# EAGLE design etcolor (EAGLE 6.1)
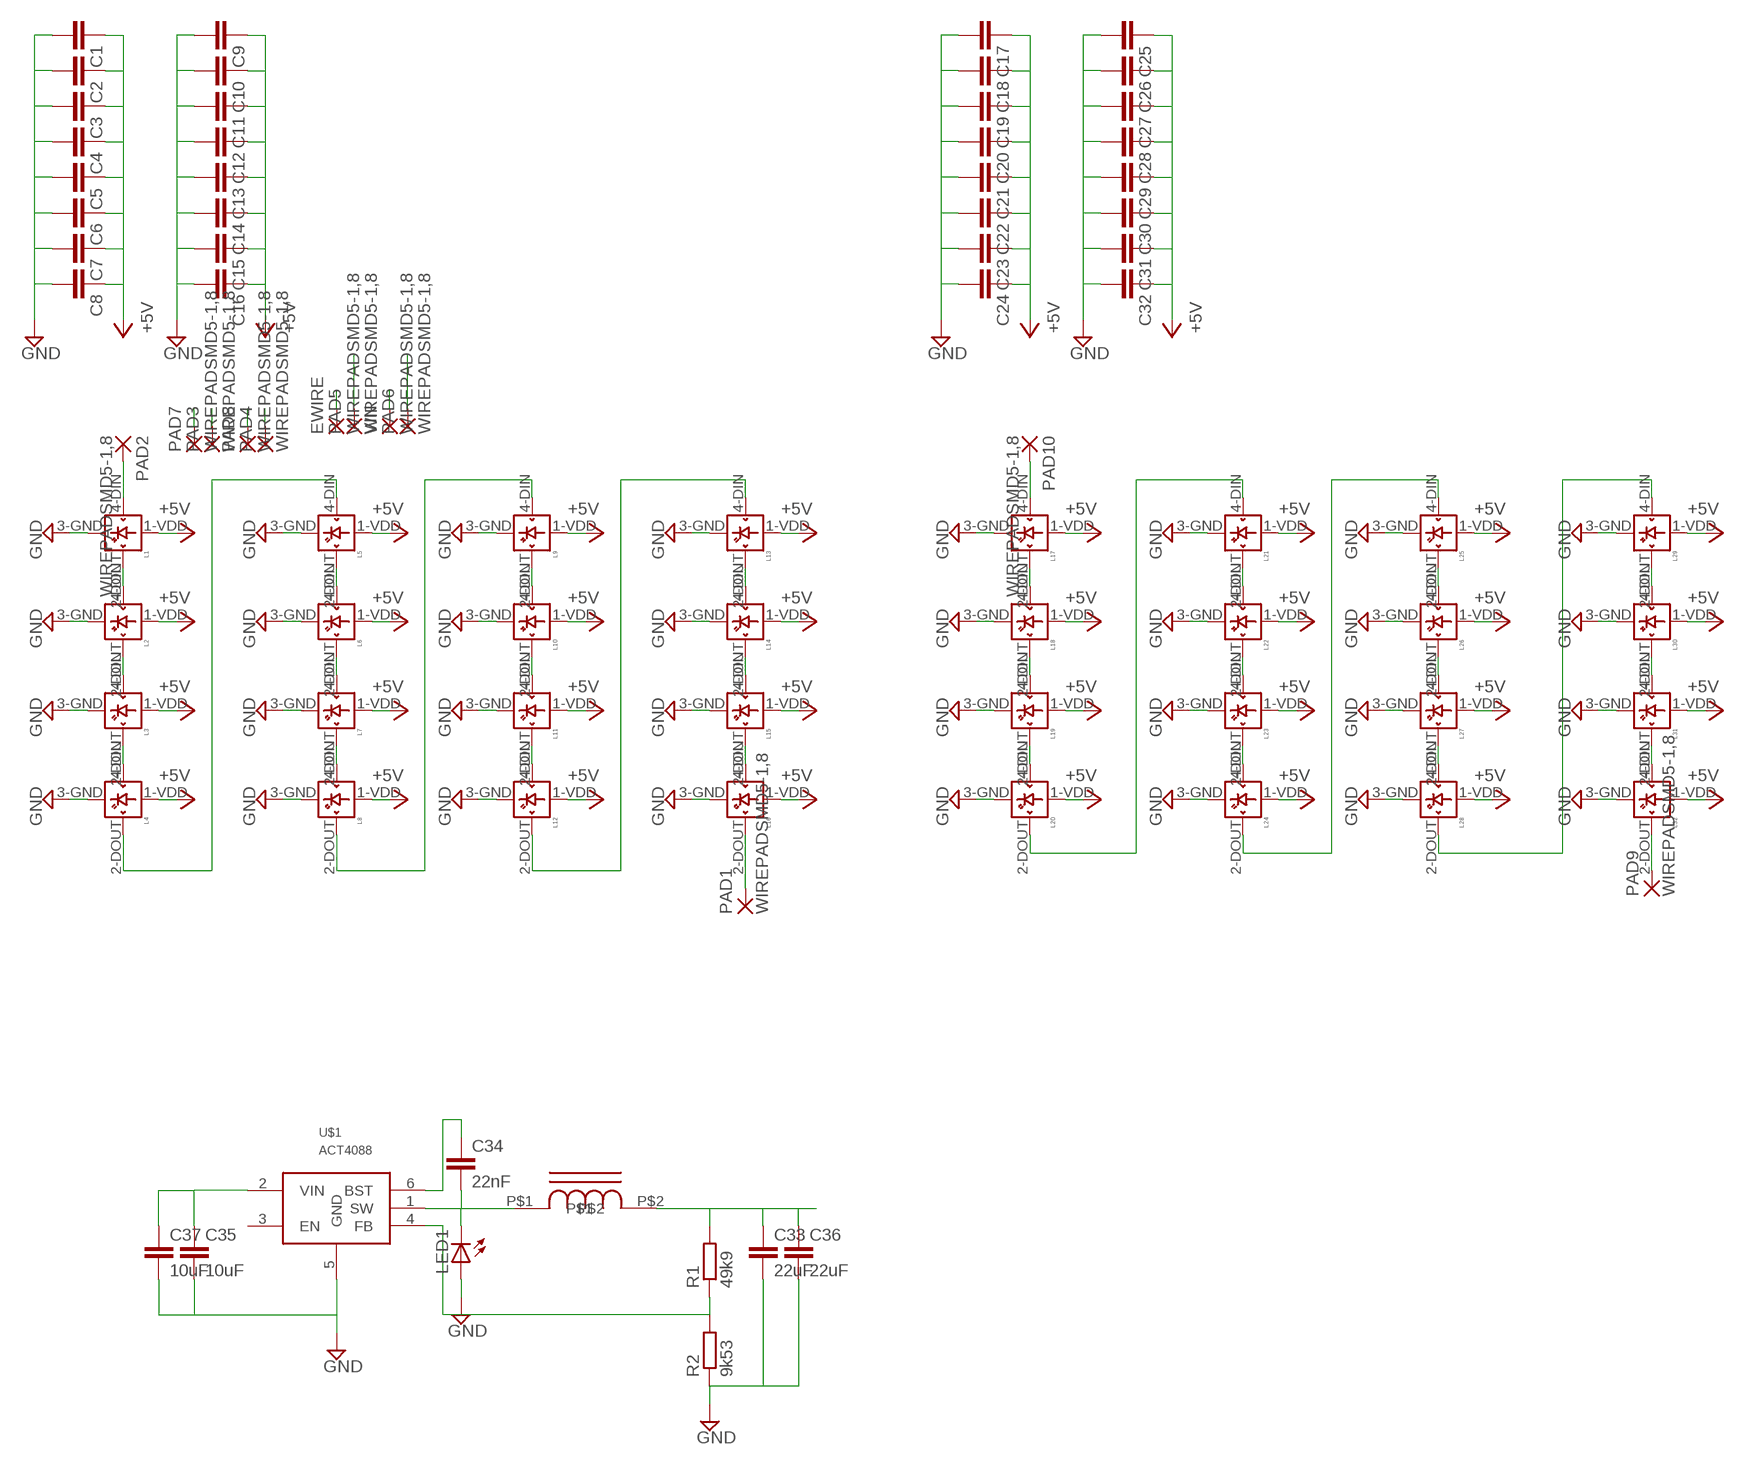
[diagram p0: schematic, sheet 1]

## Parts
C1  C-EUC0805K  [C0805K]
C2  C-EUC0805K  [C0805K]
C3  C-EUC0805K  [C0805K]
C4  C-EUC0805K  [C0805K]
C5  C-EUC0805K  [C0805K]
C6  C-EUC0805K  [C0805K]
C7  C-EUC0805K  [C0805K]
C8  C-EUC0805K  [C0805K]
C9  C-EUC0805K  [C0805K]
C10  C-EUC0805K  [C0805K]
C11  C-EUC0805K  [C0805K]
C12  C-EUC0805K  [C0805K]
C13  C-EUC0805K  [C0805K]
C14  C-EUC0805K  [C0805K]
C15  C-EUC0805K  [C0805K]
C16  C-EUC0805K  [C0805K]
C17  C-EUC0805K  [C0805K]
C18  C-EUC0805K  [C0805K]
C19  C-EUC0805K  [C0805K]
C20  C-EUC0805K  [C0805K]
C21  C-EUC0805K  [C0805K]
C22  C-EUC0805K  [C0805K]
C23  C-EUC0805K  [C0805K]
C24  C-EUC0805K  [C0805K]
C25  C-EUC0805K  [C0805K]
C26  C-EUC0805K  [C0805K]
C27  C-EUC0805K  [C0805K]
C28  C-EUC0805K  [C0805K]
C29  C-EUC0805K  [C0805K]
C30  C-EUC0805K  [C0805K]
C31  C-EUC0805K  [C0805K]
C32  C-EUC0805K  [C0805K]
C33  22uF  C-EUC1210  [C1210]
C34  22nF  C-EUC0805  [C0805]
C35  10uF  C-EUC1210  [C1210]
C36  22uF  C-EUC1210  [C1210]
C37  10uF  C-EUC1210  [C1210]
EWIRE  WIREPADSMD5-1,8  [5-1,8]
L1  WS2812B  [WS2812B]
L2  WS2812B  [WS2812B]
L3  WS2812B  [WS2812B]
L4  WS2812B  [WS2812B]
L5  WS2812B  [WS2812B]
L6  WS2812B  [WS2812B]
L7  WS2812B  [WS2812B]
L8  WS2812B  [WS2812B]
L9  WS2812B  [WS2812B]
L10  WS2812B  [WS2812B]
L11  WS2812B  [WS2812B]
L12  WS2812B  [WS2812B]
L13  WS2812B  [WS2812B]
L14  WS2812B  [WS2812B]
L15  WS2812B  [WS2812B]
L16  WS2812B  [WS2812B]
L17  WS2812B  [WS2812B]
L18  WS2812B  [WS2812B]
L19  WS2812B  [WS2812B]
L20  WS2812B  [WS2812B]
L21  WS2812B  [WS2812B]
L22  WS2812B  [WS2812B]
L23  WS2812B  [WS2812B]
L24  WS2812B  [WS2812B]
L25  WS2812B  [WS2812B]
L26  WS2812B  [WS2812B]
L27  WS2812B  [WS2812B]
L28  WS2812B  [WS2812B]
L29  WS2812B  [WS2812B]
L30  WS2812B  [WS2812B]
L31  WS2812B  [WS2812B]
L32  WS2812B  [WS2812B]
LED1  LED1206  [LED-1206]
PAD1  WIREPADSMD5-1,8  [5-1,8]
PAD2  WIREPADSMD5-1,8  [5-1,8]
PAD3  WIREPADSMD5-1,8  [5-1,8]
PAD4  WIREPADSMD5-1,8  [5-1,8]
PAD5  WIREPADSMD5-1,8  [5-1,8]
PAD6  WIREPADSMD5-1,8  [5-1,8]
PAD7  WIREPADSMD5-1,8  [5-1,8]
PAD8  WIREPADSMD5-1,8  [5-1,8]
PAD9  WIREPADSMD5-1,8  [5-1,8]
PAD10  WIREPADSMD5-1,8  [5-1,8]
R1  49k9  R-EU_M0805  [M0805]
R2  9k53  R-EU_M0805  [M0805]
U$1  ACT4088  [SOT23-6]
U$2  INDUCTOR  [6060]
VIN  WIREPADSMD5-1,8  [5-1,8]

## Nets
+5V: C1.1 C2.1 C3.1 C4.1 C5.1 C6.1 C7.1 C8.1 C9.1 C10.1 C11.1 C12.1 C13.1 C14.1 C15.1 C16.1 C17.1 C18.1 C19.1 C20.1 C21.1 C22.1 C23.1 C24.1 C25.1 C26.1 C27.1 C28.1 C29.1 C30.1 C31.1 C32.1 C33.1 C36.1 L1.1-VDD(VDD) L2.1-VDD(VDD) L3.1-VDD(VDD) L4.1-VDD(VDD) L5.1-VDD(VDD) L6.1-VDD(VDD) L7.1-VDD(VDD) L8.1-VDD(VDD) L9.1-VDD(VDD) L10.1-VDD(VDD) L11.1-VDD(VDD) L12.1-VDD(VDD) L13.1-VDD(VDD) L14.1-VDD(VDD) L15.1-VDD(VDD) L16.1-VDD(VDD) L17.1-VDD(VDD) L18.1-VDD(VDD) L19.1-VDD(VDD) L20.1-VDD(VDD) L21.1-VDD(VDD) L22.1-VDD(VDD) L23.1-VDD(VDD) L24.1-VDD(VDD) L25.1-VDD(VDD) L26.1-VDD(VDD) L27.1-VDD(VDD) L28.1-VDD(VDD) L29.1-VDD(VDD) L30.1-VDD(VDD) L31.1-VDD(VDD) L32.1-VDD(VDD) R1.2 U$2.P$2
BTS: C34.1 U$1.6(BST)
DATAIN1: L1.4-DIN(DIN) PAD2.1(P)
DATAIN2: L17.4-DIN(DIN) PAD10.1(P)
DATAOUT1: L16.2-DOUT(DOUT) PAD1.1(P)
DATAOUT2: L32.2-DOUT(DOUT) PAD9.1(P)
FB: R1.1 R2.2 U$1.4(FB)
GND: C1.2 C2.2 C3.2 C4.2 C5.2 C6.2 C7.2 C8.2 C9.2 C10.2 C11.2 C12.2 C13.2 C14.2 C15.2 C16.2 C17.2 C18.2 C19.2 C20.2 C21.2 C22.2 C23.2 C24.2 C25.2 C26.2 C27.2 C28.2 C29.2 C30.2 C31.2 C32.2 C33.2 C35.2 C36.2 C37.2 L1.3-GND(GND) L2.3-GND(GND) L3.3-GND(GND) L4.3-GND(GND) L5.3-GND(GND) L6.3-GND(GND) L7.3-GND(GND) L8.3-GND(GND) L9.3-GND(GND) L10.3-GND(GND) L11.3-GND(GND) L12.3-GND(GND) L13.3-GND(GND) L14.3-GND(GND) L15.3-GND(GND) L16.3-GND(GND) L17.3-GND(GND) L18.3-GND(GND) L19.3-GND(GND) L20.3-GND(GND) L21.3-GND(GND) L22.3-GND(GND) L23.3-GND(GND) L24.3-GND(GND) L25.3-GND(GND) L26.3-GND(GND) L27.3-GND(GND) L28.3-GND(GND) L29.3-GND(GND) L30.3-GND(GND) L31.3-GND(GND) L32.3-GND(GND) LED1.A PAD3.1(P) PAD4.1(P) PAD7.1(P) PAD8.1(P) R2.1 U$1.5(GND)
N$1: L1.2-DOUT(DOUT) L2.4-DIN(DIN)
N$2: L2.2-DOUT(DOUT) L3.4-DIN(DIN)
N$4: L3.2-DOUT(DOUT) L4.4-DIN(DIN)
N$5: L4.2-DOUT(DOUT) L5.4-DIN(DIN)
N$6: L5.2-DOUT(DOUT) L6.4-DIN(DIN)
N$7: L6.2-DOUT(DOUT) L7.4-DIN(DIN)
N$8: L7.2-DOUT(DOUT) L8.4-DIN(DIN)
N$9: L8.2-DOUT(DOUT) L9.4-DIN(DIN)
N$10: L9.2-DOUT(DOUT) L10.4-DIN(DIN)
N$11: L10.2-DOUT(DOUT) L11.4-DIN(DIN)
N$12: L11.2-DOUT(DOUT) L12.4-DIN(DIN)
N$13: L12.2-DOUT(DOUT) L13.4-DIN(DIN)
N$14: L13.2-DOUT(DOUT) L14.4-DIN(DIN)
N$15: L14.2-DOUT(DOUT) L15.4-DIN(DIN)
N$16: L15.2-DOUT(DOUT) L16.4-DIN(DIN)
N$18: L17.2-DOUT(DOUT) L18.4-DIN(DIN)
N$19: L18.2-DOUT(DOUT) L19.4-DIN(DIN)
N$20: L19.2-DOUT(DOUT) L20.4-DIN(DIN)
N$21: L20.2-DOUT(DOUT) L21.4-DIN(DIN)
N$22: L21.2-DOUT(DOUT) L22.4-DIN(DIN)
N$23: L22.2-DOUT(DOUT) L23.4-DIN(DIN)
N$24: L23.2-DOUT(DOUT) L24.4-DIN(DIN)
N$25: L24.2-DOUT(DOUT) L25.4-DIN(DIN)
N$26: L25.2-DOUT(DOUT) L26.4-DIN(DIN)
N$27: L26.2-DOUT(DOUT) L27.4-DIN(DIN)
N$28: L27.2-DOUT(DOUT) L28.4-DIN(DIN)
N$29: L28.2-DOUT(DOUT) L29.4-DIN(DIN)
N$30: L29.2-DOUT(DOUT) L30.4-DIN(DIN)
N$31: L30.2-DOUT(DOUT) L31.4-DIN(DIN)
N$32: L31.2-DOUT(DOUT) L32.4-DIN(DIN)
SW: C34.2 LED1.C U$1.1(SW) U$2.P$1
VIN: C35.1 C37.1 EWIRE.1(P) PAD5.1(P) PAD6.1(P) U$1.2(VIN) VIN.1(P)
Unconnected: U$1.3(EN)

## Library data of the parts
C1-C32 C34 = resistor:C-EU: CAPACITOR, European symbol
C33 C35-C37 = rcl:C-EU: CAPACITOR, European symbol
EWIRE PAD1-PAD10 VIN = wirepad:WIREPAD: Wire PAD connect wire on PCB
L1-L32 = adafruit:WS2812B
LED1 = LilyPad-Wearables:LED: LEDs Standard schematic elements and footprints for 5mm, 3mm, 1206, and 0603 sized LEDs. 5mm - Spark Fun Electronics SKU : Comp-SBL
R1 R2 = rcl:R-EU_: RESISTOR, European symbol
U$1 = wes:ACT4088
U$2 = wes:INDUCTOR

## Board
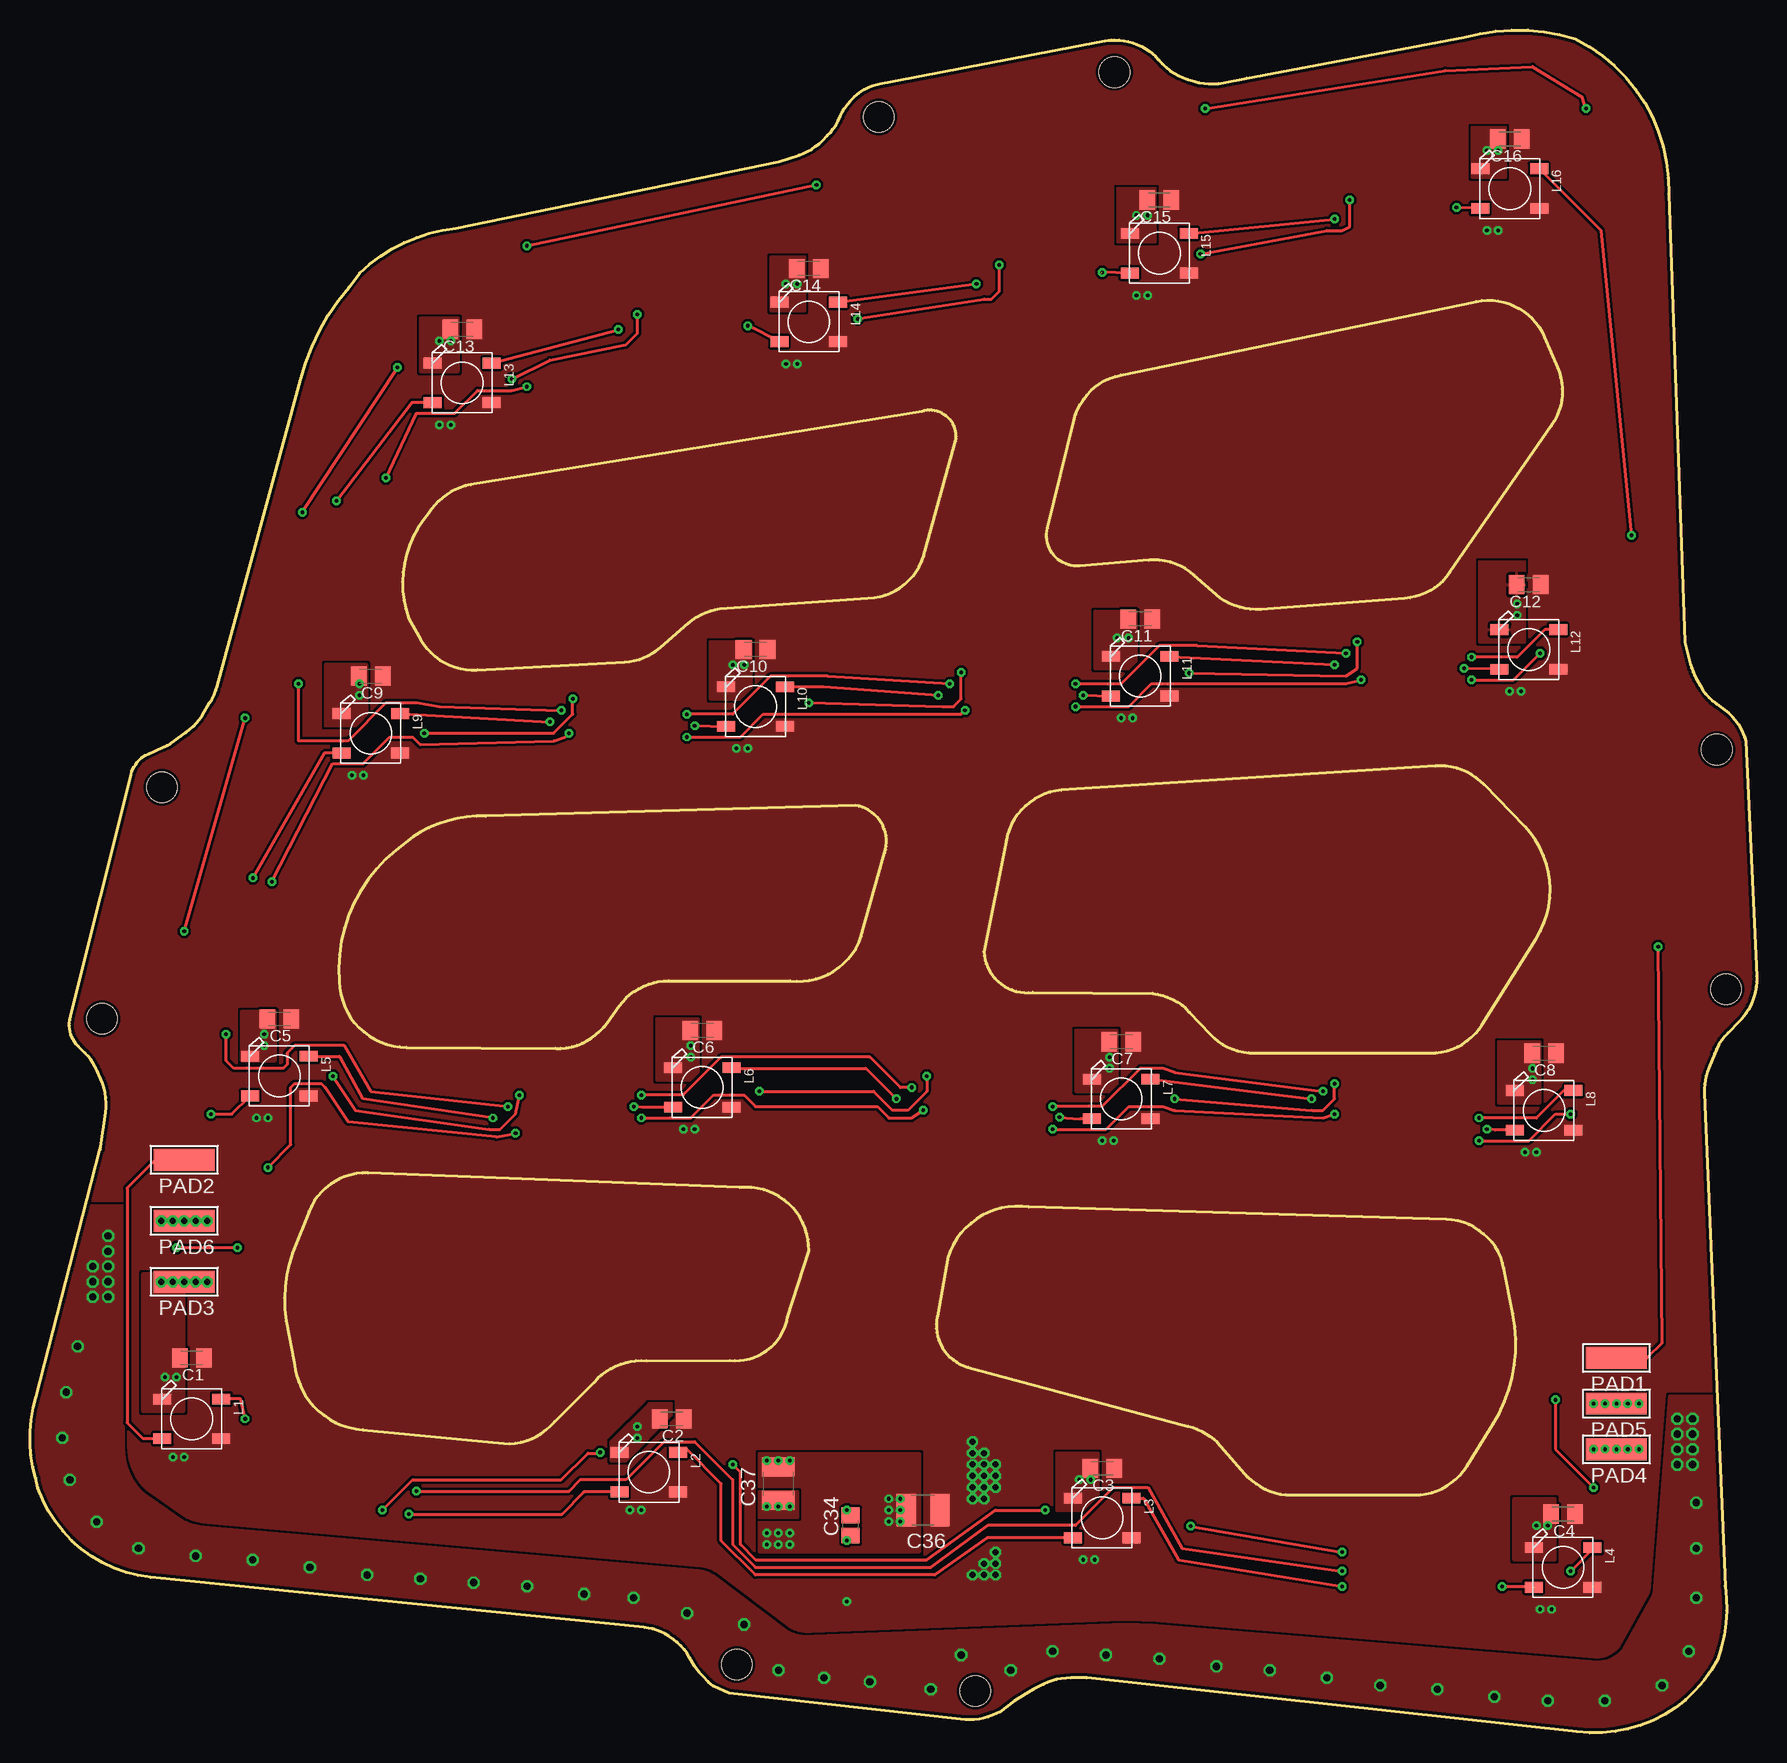
[diagram p1: board, top side]
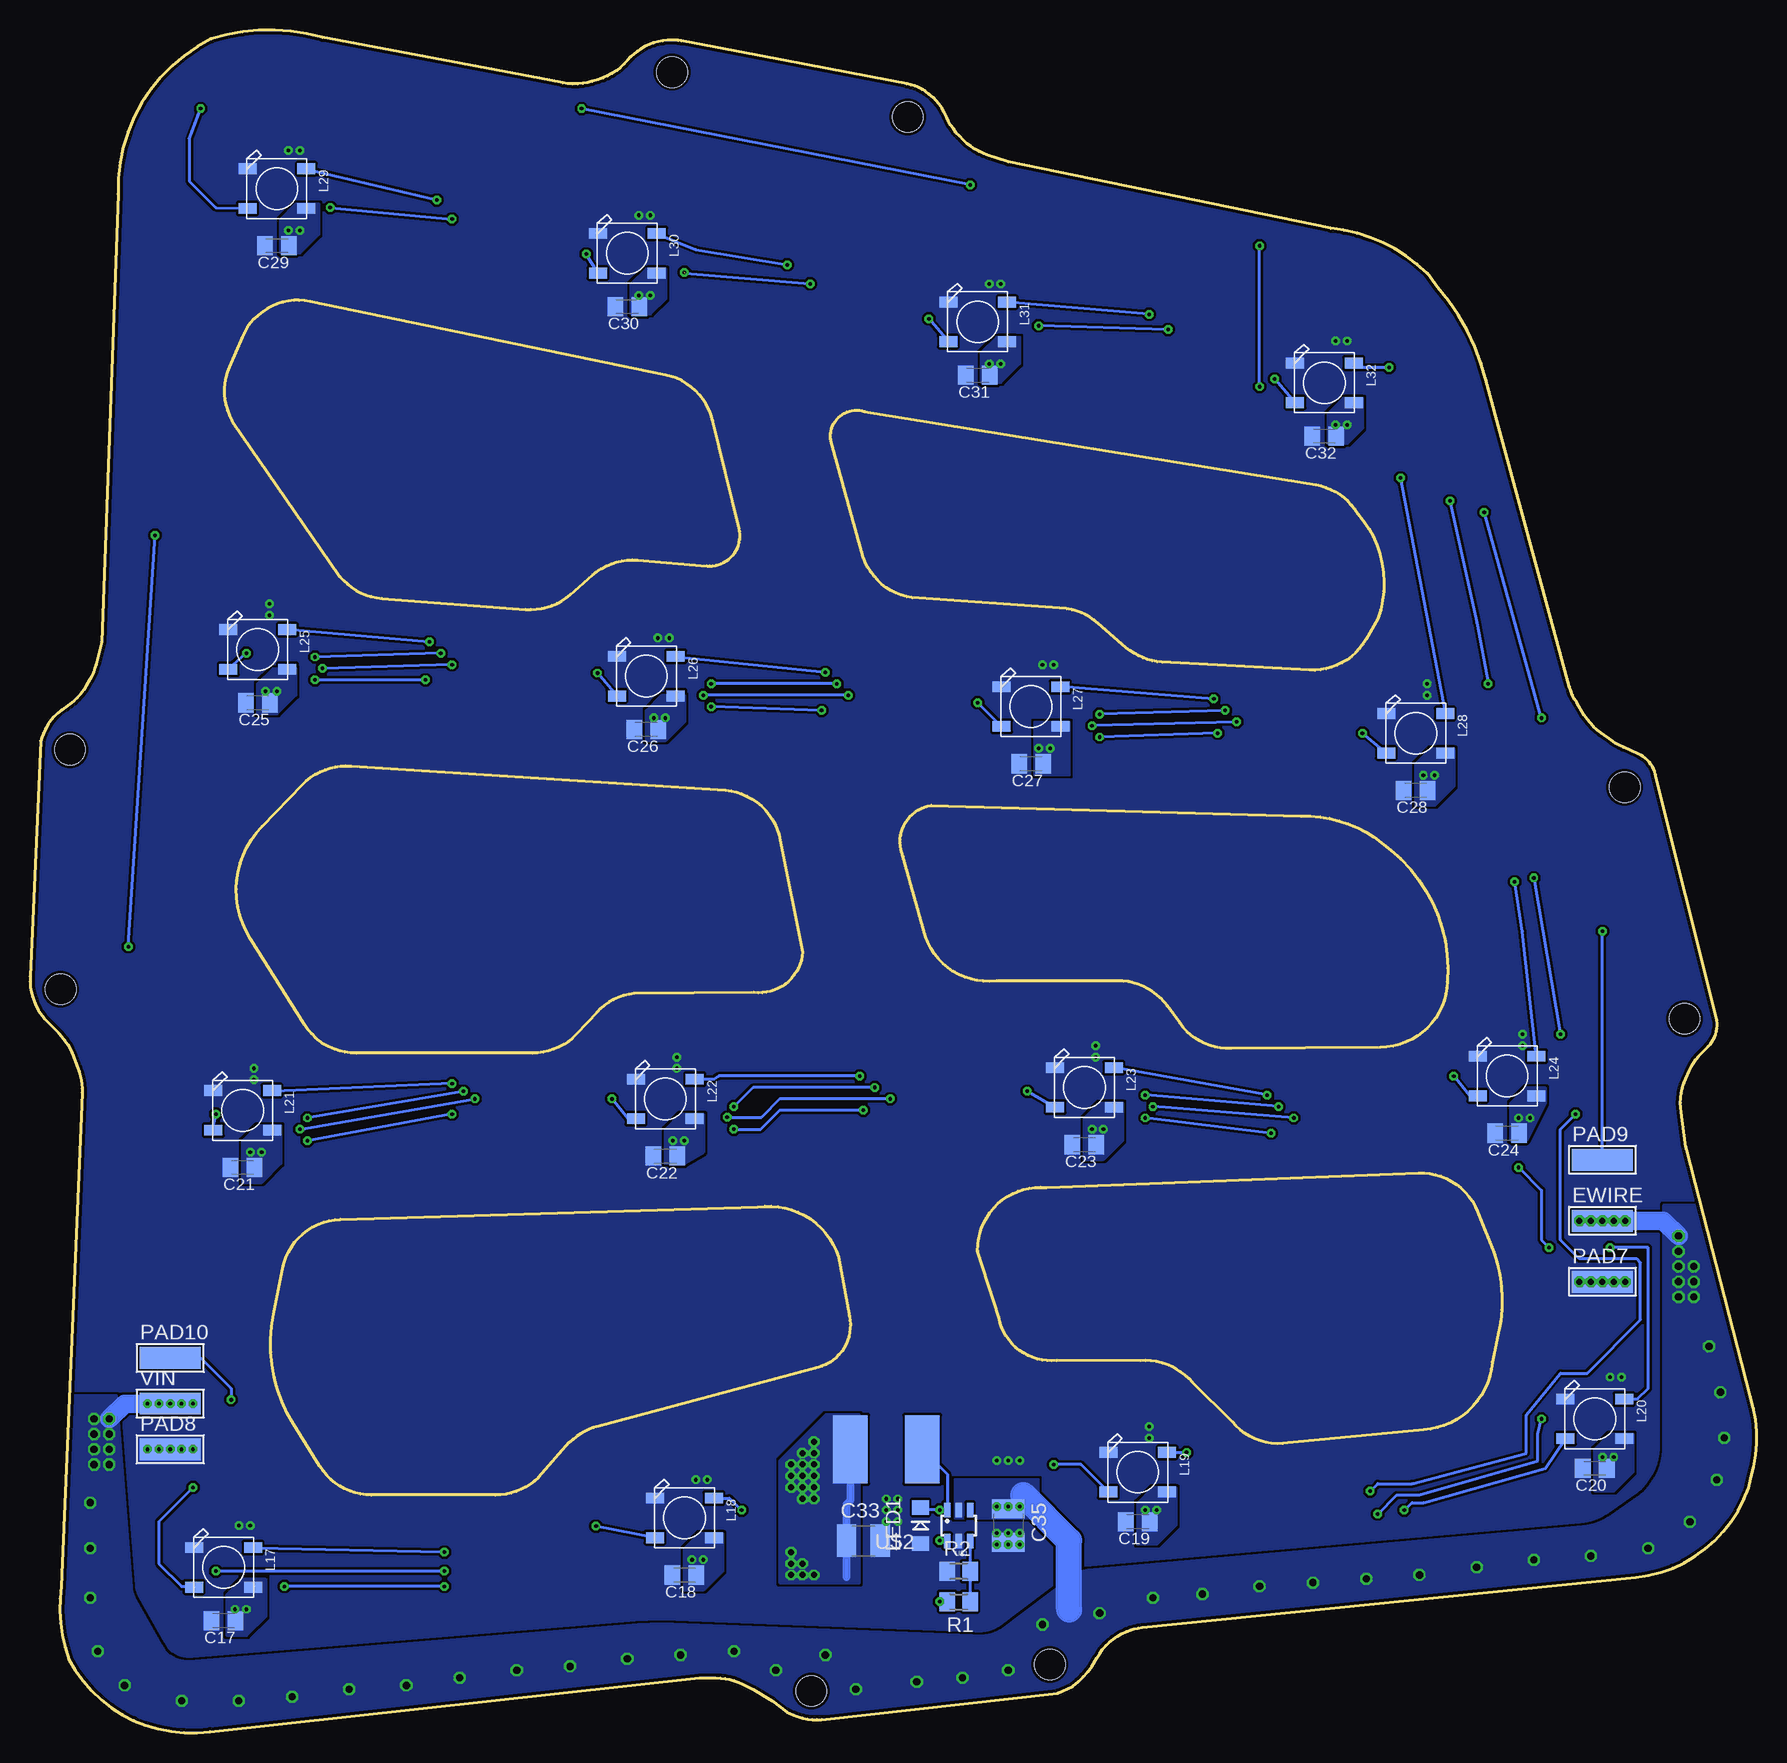
[diagram p2: board, bottom side, seen from below]

Size 143.92 x 141.94 mm. Coordinates in mm from the lower left corner, seen from the top.
Outline: 0.66,20.42 0.49,21.22 arc-34 0.51,28.03 5.83,48.57 arc6 5.89,48.85 6.3,51.71 arc32 5.91,54.49 5.62,55.15 arc21 4.57,56.68 4.03,57.22 arc-59 3.36,59.63 8.43,79.89 arc-52 9.86,81.6 11.11,82.15 arc12 12,82.66 12.99,83.37 arc22 14.34,84.81 15,85.86 arc17 15.59,87.21 22.56,112.78 arc-27 26.6,120.5 27.46,121.68 arc-38 35.5,125.41 62.38,130.94 64.1,131.51 arc27 66.09,132.74 66.45,133.11 arc22 67.53,134.7 arc-33 69.3,136.82 arc-23 70.84,137.45 89.62,141.03 arc-11 90.39,141.1 arc-27 92.67,140.57 arc-24 94.09,139.43 94.11,139.42 arc33 96.55,137.8 97.05,137.66 arc28 99.5,137.54 101.44,137.93 119.56,141.32 arc-34 128.81,141.2 arc-65 136.58,128.26 137.95,90.94 138.41,89.08 arc16 138.93,87.79 139.22,87.28 arc28 140.94,85.5 arc-40 142.94,82.96 143.03,82.68 143.92,63.05 arc-29 143.39,60.54 arc-18 142.46,59.25 141.54,58.34 arc23 140.42,56.63 139.94,55.44 arc24 139.58,53.34 141.31,12.22 arc-28 140.68,6.14 arc-70 128.92,0.1 88.1,4.58 86.76,4.58 arc27 84.49,4.04 83.66,3.62 82.07,2.67 80.8,1.72 80.6,1.62 arc-27 78.33,1.08 77.94,1.08 58.26,3.31 56.97,3.89 arc-14 55.38,5.55 54.97,6.27 arc37 52.56,8.42 arc17 51.2,8.78 10.06,12.95 arc-65 0.66,20.42
Copper layers (1*16): Top 0.035mm / dielectric 1.5mm / Bottom 0.035mm
Design rules: minimum track width 6mil, minimum drill 10mil, track to track 8mil, track to pad 8mil, pad to pad 8mil, via to via 8mil, smd to smd 0mil, copper to edge 10mil, drill to drill 8mil, minimum pad ring 10mil, minimum via ring 8mil, stop-mask expansion 4mil, vias tented up to drill 0mil, thermal gap 10mil
Holes 2.54 mm at 58.91,5.68 78.8,3.48 5.99,59.52 10.99,78.82 70.76,134.7 90.4,138.42 140.6,81.95 141.36,61.97
Milling: 83 lines

### Footprints (pad centres in the part's own frame; a part is rotated, then mirrored left to right if it is on the bottom)
C0805K = smd 1.3 x 1.6: 1 -1,0; 2 1,0
C1210 = smd 1.6 x 2.7: 1 -1.4,0; 2 1.4,0
C0805 = smd 1.3 x 1.5: 1 -0.85,0; 2 0.85,0
5-1,8 = smd 1.829 x 5.08: 1 0,0
WS2812B = smd 1.5 x 0.9: 1-VDD 2.45,-1.65; 2-DOUT 2.45,1.65; 3-GND -2.45,1.65; 4-DIN -2.45,-1.65
LED-1206 = smd 1.2 x 1.4: A -1.5,0; C 1.5,0
M0805 = smd 1.3 x 1.6: 1 -0.95,0; 2 0.95,0
SOT23-6 = smd 0.55 x 1.2: 1 0.95,-1.3; 2 0,-1.3; 3 -0.95,-1.3; 4 -0.95,1.3; 5 0,1.3; 6 0.95,1.3
6060 = smd 2.9 x 5.7: P$1 -3,0; P$2 3,0

### Placement (x,y rotation side)
C1  13.49,31.25 180 top
C2  53.49,26.17 180 top
C3  89.37,22.04 180 top
C4  127.79,18.23 180 top
C5  20.79,59.5 180 top
C6  56.03,58.55 180 top
C7  90.96,57.6 180 top
C8  126.2,56.65 180 top
C9  28.41,88.08 180 top
C10  60.48,90.3 180 top
C11  92.55,92.84 180 top
C12  124.93,95.7 180 top
C13  36.03,116.97 180 top
C14  64.92,122.05 180 top
C15  94.13,127.77 180 top
C16  123.34,132.85 180 top
C17  127.79,9.34 180 bottom
C18  89.37,13.15 180 bottom
C19  51.59,17.59 180 bottom
C20  13.49,22.04 180 bottom
C21  126.2,47.12 180 bottom
C22  90.96,48.07 180 bottom
C23  56.03,49.03 180 bottom
C24  20.79,49.98 180 bottom
C25  124.93,85.86 180 bottom
C26  92.55,83.63 180 bottom
C27  60.48,80.78 180 bottom
C28  28.41,78.55 180 bottom
C29  123.34,123.96 180 bottom
C30  94.13,118.88 180 bottom
C31  64.92,113.16 180 bottom
C32  36.03,108.08 180 bottom
C33  74.45,16.01 0 bottom
C34  68.42,17.28 90 top
C35  62.38,17.28 270 bottom
C36  74.45,18.55 180 top
C37  62.38,20.77 90 top
EWIRE  12.85,42.68 270 bottom
L1  13.49,26.17 0 top
L2  51.59,21.72 0 top
L3  89.37,17.91 0 top
L4  127.79,13.78 0 top
L5  20.79,54.74 0 top
L6  56.03,53.79 0 top
L7  90.96,52.84 0 top
L8  126.2,51.88 0 top
L9  28.41,83.32 0 top
L10  60.48,85.54 0 top
L11  92.55,88.08 0 top
L12  124.93,90.3 0 top
L13  36.03,112.53 0 top
L14  64.92,117.61 0 top
L15  94.13,123.32 0 top
L16  123.34,128.72 0 top
L17  127.79,13.78 0 bottom
L18  89.37,17.91 0 bottom
L19  51.59,21.72 0 bottom
L20  13.49,26.17 0 bottom
L21  126.2,51.88 0 bottom
L22  90.96,52.84 0 bottom
L23  56.03,53.79 0 bottom
L24  20.79,54.74 0 bottom
L25  124.93,90.3 0 bottom
L26  92.55,88.08 0 bottom
L27  60.48,85.54 0 bottom
L28  28.41,83.32 0 bottom
L29  123.34,128.72 0 bottom
L30  94.13,123.32 0 bottom
L31  64.92,117.61 0 bottom
L32  36.03,112.53 0 bottom
LED1  69.69,17.28 90 bottom
PAD1  132.23,31.25 90 top
PAD2  12.85,47.76 90 top
PAD3  12.85,37.6 90 top
PAD4  132.23,23.63 90 top
PAD5  132.23,27.44 90 top
PAD6  12.85,42.68 90 top
PAD7  12.85,37.6 270 bottom
PAD8  132.23,23.63 270 bottom
PAD9  12.85,47.76 270 bottom
PAD10  132.23,31.25 270 bottom
R1  66.51,10.93 180 bottom
R2  66.51,13.47 0 bottom
U$1  66.51,17.28 180 bottom
U$2  72.54,23.63 180 bottom
VIN  132.23,27.44 270 bottom

### Tracks (layer width: path | path; a pad name or v marks a point on that pad's centre or on a via)
+5V  (via drill 0.3, 0.5)
  Bottom 0.254: R1.2 v68.1,10.93
  Bottom 0.61: 75.85,12.96 C33.1 75.85,19.05 75.54,19.36 U$2.P$2
  other vias: 18.89,51.25 19.84,51.25 55.4,50.3 54.45,50.3 90.32,49.34 89.37,49.34 125.57,48.39 124.61,48.39 124.3,86.81 123.34,86.81 91.91,84.59 90.96,84.59 59.84,82.05 58.89,82.05 27.78,79.82 26.82,79.82 78.58,22.36 78.58,24.26 79.53,23.31 80.48,22.36 79.53,22.36 78.58,23.31 78.58,21.4 79.53,21.4 80.48,21.4 80.48,20.45 79.53,20.45 78.58,20.45 78.58,19.5 79.53,19.5 80.48,13.15 80.48,14.1 79.53,13.15 79.53,14.1 78.58,13.15 80.48,15.05 34.13,109.03 35.08,109.03 63.02,114.11 63.97,114.11 92.23,119.83 93.18,119.83 121.44,125.23 122.39,125.23 126.84,10.29 125.88,10.29 88.74,14.42 87.78,14.42 50.95,18.55 50,18.55 12.85,22.99 11.9,22.99
  pour Top (rank 6, no thermals): -7.47,146.82 150.01,146.82 150.01,-1.77 -7.47,-1.77
  pour Bottom (no thermals): 17.62,53.79 17.62,52.52 19.2,49.34 20.47,49.34 20.47,52.52 19.2,53.79
  pour Bottom (no thermals): 52.86,52.52 52.86,49.34 54.45,47.76 56.03,47.76 56.03,51.25 54.76,52.52
  pour Bottom (no thermals): 87.78,51.57 87.78,48.39 89.37,47.44 90.96,47.44 90.96,50.3 89.69,51.57
  pour Bottom (no thermals): 123.03,50.61 123.03,47.44 124.61,45.85 126.2,45.85 126.2,49.34 124.93,50.61
  pour Bottom (no thermals): 121.76,88.71 121.76,86.49 123.34,84.9 124.93,84.9 124.93,87.44 123.66,88.71
  pour Bottom (no thermals): 89.37,86.49 89.37,84.27 90.96,82.68 92.55,82.68 92.55,85.22 91.28,86.49
  pour Bottom (no thermals): 57.3,84.27 57.3,79.82 60.16,79.82 60.16,84.27
  pour Bottom (no thermals): 25.24,82.05 25.24,78.87 26.82,77.28 28.41,77.28 28.41,80.78 27.14,82.05
  pour Bottom (rank 2, no thermals): 74.77,12.51 74.77,26.48 77.62,26.48 81.43,22.67 81.43,12.51
  pour Bottom (no thermals): 119.85,127.45 119.85,124.91 121.44,123.32 123.03,123.32 123.03,126.18 121.76,127.45
  pour Bottom (no thermals): 90.96,122.05 90.96,119.51 92.23,118.24 93.82,118.24 93.82,120.78 92.55,122.05
  pour Bottom (no thermals): 61.43,116.34 61.43,114.11 63.02,112.53 64.61,112.53 64.61,115.07 63.34,116.34
  pour Bottom (no thermals): 32.86,111.26 32.86,108.72 34.13,107.45 35.71,107.45 35.71,109.99 34.44,111.26
  pour Bottom (no thermals): 10.31,24.9 10.31,21.72 11.9,20.13 13.49,20.13 13.49,23.63 12.22,24.9
  pour Bottom (no thermals): 48.41,20.45 48.41,17.28 50,15.69 51.59,15.69 51.59,19.18 50.32,20.45
  pour Bottom (no thermals): 86.2,16.64 86.2,13.47 87.78,11.88 89.37,11.88 89.37,15.37 88.1,16.64
  pour Bottom (no thermals): 124.3,12.83 124.3,9.66 125.88,8.07 127.47,8.07 127.47,11.56 126.2,12.83
BTS  (via drill 0.3)
  Top 0.406: v68.1,16.01 C34.1
  Bottom 0.406: U$1.6 68.1,15.98 v68.1,16.01
DATAIN1
  Top 0.254: L1.4-DIN 9.42,24.52 8.09,25.85 8.09,45.41 10.44,47.76 PAD2.1
DATAIN2  (via drill 0.3)  (1 unrouted)
  Top 0.254: v127.15,27.75 127.15,23.63 v130.33,20.45
  Bottom 0.254: PAD10.1 129.69,31.25 127.15,28.71 v127.15,27.75 | v130.33,20.45 133.19,17.59 133.19,14.1 131.28,12.2 130.33,12.2
DATAOUT1  (via drill 0.3)
  Top 0.254: PAD1.1 134.77,31.25 136.04,32.52 v135.73,65.54 | v133.5,99.83 130.96,125.23 L16.2-DOUT
  Bottom 0.254: v135.73,65.54 v133.5,99.83
DATAOUT2  (via drill 0.3)
  Top 0.254: v12.85,66.81 v17.93,84.59 | v22.7,101.73 v30.63,113.8
  Bottom 0.254: L32.2-DOUT 33.55,114.18 33.17,113.8 v30.63,113.8 | PAD9.1 v12.85,66.81 | v17.93,84.59 v22.7,101.73
FB
  Bottom 0.254: U$1.4 R2.2 R1.1
GND  (via drill 0.3, 0.5)
  other vias: 35.08,116.02 34.13,116.02 63.97,120.78 63.02,120.78 92.23,126.5 93.18,126.5 121.44,131.89 122.39,131.89 11.27,29.66 12.22,29.66 50.64,25.53 50.64,24.58 88.42,21.09 87.47,21.09 125.57,17.28 126.52,17.28 125.25,55.38 125.25,54.42 90.01,56.33 90.01,55.38 55.08,57.28 55.08,56.33 19.52,58.23 19.52,57.28 123.98,94.11 123.98,93.16 90.64,91.25 91.59,91.25 58.57,89.03 59.53,89.03 27.46,87.44 27.46,86.49 14.76,37.6 13.81,37.6 12.85,37.6 11.9,37.6 10.95,37.6 134.14,23.63 133.19,23.63 132.23,23.63 131.28,23.63 130.33,23.63 62.38,22.67 63.34,22.67 61.43,22.67 63.34,15.69 62.38,15.69 61.43,15.69 72.54,17.59 72.54,18.55 72.54,19.5 61.43,16.64 62.38,16.64 63.34,16.64 71.59,17.59 71.59,18.55 71.59,19.5
  pour Top (no thermals): 32.54,117.92 32.54,113.48 35.71,113.48 35.71,117.92
  pour Top (no thermals): 61.75,123 61.75,118.56 64.61,118.56 64.61,123
  pour Top (no thermals): 90.64,128.72 90.64,124.27 93.82,124.27 93.82,128.72
  pour Top (no thermals): 120.17,133.8 120.17,129.67 123.03,129.67 123.03,133.8
  pour Top: 120.8,97.6 120.8,90.94 124.61,90.94 124.61,97.6
  pour Top (no thermals): 88.74,93.48 88.74,88.71 92.23,88.71 92.23,93.48
  pour Top (no thermals): 56.67,90.94 56.67,86.17 60.16,86.17 60.16,90.94
  pour Top (no thermals): 24.6,89.03 24.6,83.95 28.09,83.95 28.09,89.03
  pour Top (no thermals): 17.62,60.14 17.62,56.01 20.47,56.01 20.47,60.14
  pour Top (no thermals): 52.22,59.5 52.22,54.42 55.72,54.42 55.72,59.5
  pour Top (no thermals): 123.66,19.5 123.66,14.42 127.15,14.42 127.15,19.5
  pour Top (no thermals): 85.56,23.31 85.56,18.55 88.29,18.55 89.05,19.31 89.05,23.31
  pour Top (no thermals): 9.36,38.23 9.36,26.8 12.85,26.8 12.85,38.23
  pour Top (no thermals): 48.41,22.67 49.68,22.67 53.49,26.48 53.49,27.44 51.59,27.44 48.41,24.26
  pour Top (no thermals): 87.15,58.55 87.15,53.47 90.64,53.47 90.64,58.55
  pour Top (no thermals): 122.39,57.6 122.39,52.52 125.88,52.52 125.88,57.6
  pour Top (rank 2, no thermals): 60.8,23.31 74.13,23.31 74.13,15.05 60.8,15.05
  pour Bottom (rank 5, no thermals): 2.69,143.01 147.47,143.01 147.47,-5.58 2.69,-5.58
N$1  (via drill 0.3)
  Top 0.254: L2.4-DIN 46.19,20.07 | 46.19,20.07 46.13,20.07 | 16.28,27.82 L1.2-DOUT 17.55,27.82 v17.93,26.17 | v31.59,18.23 44.35,18.23 46.19,20.07
  Bottom 0.254: v31.59,18.23 30,19.82 28.09,19.82 18.25,22.67 18.25,24.9 v17.93,26.17
N$2
  Top 0.254: L3.4-DIN 79.78,16.26 75.4,13.15 60.48,13.15 57.62,16.01 57.62,20.77 54.76,23.63 54.29,23.63 L2.2-DOUT
N$4  (via drill 0.3)  (1 unrouted)
  Top 0.254: L3.2-DOUT 92.8,19.56 95.72,14.42 v109.37,12.2 | v122.71,12.2 125.25,12.2
  Bottom 0.254: v109.37,12.2 v122.71,12.2
N$5  (via drill 0.3)
  Top 0.254: L4.2-DOUT 130.24,15.28 v128.42,13.47 | 18.28,53.15 L5.4-DIN 16.82,51.57 v15.08,51.57 | v32.22,20.13 44.92,20.13 45.87,21.09 49.68,21.09 52.86,24.26 55.4,24.26 58.57,21.09 58.57,15.69 60.48,13.78 75.08,13.78 79.85,17.28 87.15,17.28 90.32,20.45 93.18,20.45 96.04,15.37 v109.37,13.47
  Bottom 0.254: v15.08,51.57 16.35,50.3 16.35,41.09 14.76,39.5 10,39.5 9.68,39.18 9.68,34.42 14.12,29.98 16.35,29.98 19.2,26.48 19.2,23.31 28.73,20.77 31.59,20.77 v32.22,20.13 | v109.37,13.47 v128.42,13.47
N$6  (via drill 0.3)
  Top 0.254: L6.4-DIN 51.02,52.14 v50.32,52.2 | L5.2-DOUT 25.81,56.39 25.87,56.33 27.78,52.84 v38.57,51.25
  Bottom 0.254: v38.57,51.25 v50.32,52.2
N$7  (via drill 0.3)
  Top 0.254: v85.82,51.31 87.53,51.19 L7.4-DIN | L6.2-DOUT 58.55,55.38 69.69,55.38 v72.23,52.84
  Bottom 0.254: v72.23,52.84 81.43,52.84 82.96,51.31 v85.82,51.31
N$8  (via drill 0.3)
  Top 0.254: L8.4-DIN 122.14,50.23 v121.44,50.3 | L7.2-DOUT v106.83,52.84
  Bottom 0.254: v121.44,50.3 v106.83,52.84
N$9  (via drill 0.3)
  Top 0.254: L8.2-DOUT 127.85,53.53 125.57,51.25 v120.8,51.25 | v50.95,53.15 54.45,53.15 57.62,56.33 70,56.33 72.54,53.79 v73.5,53.79 | L9.4-DIN 24.54,81.67 v18.57,71.25 | v85.24,52.2 89.37,52.2 92.55,55.38 94.45,55.38 95.4,55.06 v107.79,53.47 | v39.84,52.2 28.41,53.47 26.19,57.28 22.06,57.28 21.43,56.65 21.43,55.69 21.11,55.38 16.98,55.38 16.35,56.01 v16.35,58.23
  Bottom 0.254: v39.84,52.2 v50.95,53.15 | v107.79,53.47 v120.8,51.25 | v18.57,71.25 v16.35,58.23 | v73.5,53.79 83.66,53.79 v85.24,52.2
N$10  (via drill 0.3)
  Top 0.254: L9.2-DOUT v43.33,84.27 | v55.4,83.95 L10.4-DIN
  Bottom 0.254: v43.33,84.27 v55.4,83.95
N$11  (via drill 0.3)
  Top 0.254: L10.2-DOUT 66.13,87.19 v75.72,86.49 | v87.78,86.49 L11.4-DIN
  Bottom 0.254: v75.72,86.49 v87.78,86.49
N$12  (via drill 0.3)
  Top 0.254: L11.2-DOUT v108.74,89.03 | L12.4-DIN v119.53,88.71
  Bottom 0.254: v108.74,89.03 v119.53,88.71
N$13  (via drill 0.3)
  Top 0.254: L12.2-DOUT 126.26,91.95 123.98,89.67 v120.17,89.67 | v54.76,84.9 58.57,84.9 61.75,88.08 66.51,88.08 v76.67,87.44 | v22.38,87.44 22.38,82.68 26.51,82.68 29.68,85.86 32.22,85.86 34.13,85.54 v44.29,85.22 | L13.4-DIN 31.84,110.88 v25.55,102.68 | v87.15,87.44 90.96,87.44 94.13,90.62 97.31,90.62 v109.69,89.98
  Bottom 0.254: v44.29,85.22 v54.76,84.9 | v76.67,87.44 v87.15,87.44 | v109.69,89.98 v120.17,89.67 | v25.55,102.68 23.33,92.52 v22.38,87.44
N$14  (via drill 0.3)
  Top 0.254: L13.2-DOUT v49.05,116.97 | L14.4-DIN v59.84,117.29
  Bottom 0.254: v49.05,116.97 v59.84,117.29
N$15  (via drill 0.3)  (1 unrouted)
  Top 0.254: L14.2-DOUT v78.89,120.78 | L15.4-DIN v89.37,121.73
  Bottom 0.254: 89.31,121.67 v78.89,120.78
N$16  (via drill 0.3)
  Top 0.254: L15.2-DOUT v108.74,126.18 | L16.4-DIN v118.9,127.13
  Bottom 0.254: v118.9,127.13 v108.74,126.18
N$18  (via drill 0.3)  (1 unrouted)
  Top 0.254: v96.74,17.21 v109.37,15.05
  Bottom 0.254: L18.4-DIN v96.74,17.21 | v109.37,15.05 125.25,15.37
N$19  (via drill 0.3)
  Top 0.254: v84.61,18.55 80.48,18.55 74.77,14.42 60.48,14.42 59.21,15.69 59.21,21.72 v58.57,22.36
  Bottom 0.254: L18.2-DOUT 85.62,19.56 v84.61,18.55 | L19.4-DIN 56.32,22.36 v58.57,22.36
N$20  (via drill 0.3)
  Top 0.254: v47.52,23.37 47.46,23.31 46.51,23.31 44.29,21.09 31.9,21.09 v29.36,18.55
  Bottom 0.254: L19.2-DOUT v47.52,23.37 | v29.36,18.55 28.73,19.18 27.78,19.18 17.62,22.04 L20.4-DIN 16.09,24.52
N$21  (via drill 0.3)  (1 unrouted)
  Top 0.254: v12.22,40.45 v17.3,40.45 | v19.84,47.12 21.74,49.03 21.74,53.79 22.06,54.11 24.28,54.11 24.6,53.79 26.51,50.93 38.89,49.66 v40.48,49.98 | v50.95,51.25 55.08,51.25 56.99,53.15 59.53,53.15 60.48,52.2 70.64,52.2 71.59,51.25 73.5,51.25 v74.45,51.88 | v85.24,50.3 89.69,50.3 91.59,52.2 94.45,52.2 95.4,51.88 107.79,51.25 v108.74,51.57 | v120.8,49.34 124.93,49.34 127.15,51.57 v128.42,51.57
  Bottom 0.254: L20.2-DOUT 9.93,27.82 9.04,28.71 9.04,40.45 v12.22,40.45 | v19.84,47.12 17.93,45.22 17.93,41.09 v17.3,40.45 | v128.42,51.57 128.74,50.3 | v40.48,49.98 v50.95,51.25 | v108.74,51.57 v120.8,49.34 | v74.45,51.88 81.43,51.88 83.02,50.3 v85.24,50.3
N$22  (via drill 0.3)  (1 unrouted)
  Top 0.254: v95.4,52.84 106.83,51.88 107.79,51.88 108.74,52.84 v108.74,54.11
  Bottom 0.254: L22.4-DIN 94.07,51.19 v95.4,52.84 | v108.74,54.11 123.66,53.47
N$23  (via drill 0.3)
  Top 0.254: v74.77,54.74 74.77,53.47 73.18,51.88 71.91,51.88 70.32,53.47 v60.8,53.47
  Bottom 0.254: L22.2-DOUT 86.89,54.49 86.51,54.74 v74.77,54.74 | L23.4-DIN v60.8,53.47
N$24  (via drill 0.3)
  Top 0.254: v25.24,54.74 27.14,51.88 38.25,50.3 39.21,50.3 40.48,51.57 v40.79,53.15
  Bottom 0.254: L24.4-DIN 23.9,53.09 v25.24,54.74 | 53.52,55.38 L23.2-DOUT v40.79,53.15
N$25  (via drill 0.3)
  Top 0.254: v20.16,70.93 25.24,80.78 27.78,80.78 30,83 31.9,83 32.54,82.36 43.65,82.68 44.6,83 v44.92,83.32 | v54.76,83 59.21,83 61.11,84.9 77.62,84.9 v77.94,85.22 | v87.15,85.54 91.59,85.54 93.5,87.44 109.69,87.44 v110.96,87.76 | v120.17,87.76 123.66,87.76 v125.88,89.98
  Bottom 0.254: L24.2-DOUT 19.52,66.81 v20.16,70.93 | v44.92,83.32 v54.76,83 | v77.94,85.22 v87.15,85.54 | v110.96,87.76 v120.17,87.76 | v125.88,89.98 L25.4-DIN
N$26  (via drill 0.3)
  Top 0.254: v96.61,88.33 109.69,88.08 110.64,88.71 v110.64,90.94
  Bottom 0.254: L26.4-DIN v96.61,88.33 | v110.64,90.94 L25.2-DOUT
N$27  (via drill 0.3)
  Top 0.254: v64.92,85.86 76.04,85.54 76.99,85.54 77.62,86.17 v77.62,88.4
  Bottom 0.254: L27.4-DIN v64.92,85.86 | L26.2-DOUT v77.62,88.4
N$28  (via drill 0.3)
  Top 0.254: v32.86,83.32 43.65,83.32 45.24,84.9 v45.24,86.17
  Bottom 0.254: L28.4-DIN v32.86,83.32 | v45.24,86.17 L27.2-DOUT
N$29  (via drill 0.3)
  Top 0.254: v29.68,104.59 32.22,109.99 35.4,109.99 37.3,111.89 40.16,111.89 v41.43,112.21 | v129.69,135.39 129.38,136.34 125.25,138.88 117.95,138.56 v97.94,135.39 | v41.43,123.96 v65.56,129.04
  Bottom 0.254: v41.43,112.21 v41.43,123.96 | L29.4-DIN 128.42,127.13 130.65,129.35 130.65,132.85 v129.69,135.39 | v29.68,104.59 L28.2-DOUT | v65.56,129.04 v97.94,135.39
N$30  (via drill 0.3)  (1 unrouted)
  Top 0.254: v97.56,123.26 108.1,125.23 109.37,125.23 110.01,125.54 v110.01,127.77
  Bottom 0.254: L30.4-DIN v97.56,123.26 | v110.01,127.77 120.8,130.31
N$31  (via drill 0.3)
  Top 0.254: v68.99,117.86 79.53,119.51 80.16,119.51 80.8,120.15 v80.8,122.37
  Bottom 0.254: L31.4-DIN v68.99,117.86 | L30.2-DOUT 88.42,123.64 v80.8,122.37
N$32  (via drill 0.3)
  Top 0.254: v40.16,112.84 43.33,114.43 49.68,115.7 50.64,116.65 v50.64,118.24
  Bottom 0.254: L32.4-DIN v40.16,112.84 | v50.64,118.24 L31.2-DOUT
SW  (via drill 0.3)
  Top 0.254: 68.42,18.55 68.13,18.55 v68.1,18.58
  Top 0.406: 68.42,18.55 C34.2
  Bottom 0.254: U$2.P$1 67.46,21.54 U$1.1 v68.1,18.58 69.49,18.58 arc90 LED1.C
VIN  (via drill 0.3, 0.5, 0.6)
  Bottom 0.254: v14.76,42.68 v13.81,42.68 | v130.33,27.44 v131.28,27.44
  Bottom 1.524: v6.5,41.41 7.77,42.68 v10.95,42.68 v11.9,42.68 EWIRE.1 v13.81,42.68 | v131.28,27.44 VIN.1 v133.19,27.44 v134.14,27.44 136.04,27.44 v137.31,26.17
  Bottom 2.184: 57.3,10.29 57.3,16.01 61.11,19.82
  other vias: 12.85,42.68 132.23,27.44 61.43,18.86 62.38,18.86 63.34,18.86 138.58,26.17 138.58,22.36 138.9,19.18 138.9,15.37 138.9,11.24 138.27,6.8 136.04,3.94 131.28,2.67 126.52,2.67 122.07,2.99 117.31,3.62 112.55,3.94 108.1,4.58 103.34,5.21 98.9,5.53 94.13,6.16 89.69,6.48 85.24,6.8 81.75,5.21 77.62,6.48 75.08,3.62 70,4.26 66.19,4.58 62.38,5.21 59.53,9.02 54.76,9.97 50.32,11.24 46.19,11.56 41.43,12.2 36.98,12.51 32.54,12.83 28.09,13.15 23.33,13.78 18.57,14.42 13.81,14.74 9.04,15.37 5.55,17.59 3.33,21.09 2.69,24.58 3.01,28.39 3.96,32.2 5.23,37.6 6.5,40.14 6.5,38.87 5.23,38.87 6.5,37.6 6.5,36.33 5.23,36.33 137.31,24.9 138.58,24.9 137.31,23.63 138.58,23.63 137.31,22.36
  pour Bottom (no thermals): 66.83,21.09 66.83,17.91 59.84,17.91 59.84,21.09
  pour Top (no thermals): 60.8,20.13 63.97,20.13 63.97,17.91 60.8,17.91
  pour Bottom (rank 2, no thermals): -2.39,43.95 7.77,43.95 7.77,23.72 arc55 9.92,19.57 12.05,18.07 arc30 14.54,17.16 55.72,13.52 arc-28 56.88,13.12 63.02,8.48 arc33 65.36,8.07 90.26,9.02 arc-3 93.25,9.02 130.65,5.93 arc64 133,7.23 135.14,11.08 arc25 135.45,12.12 136.68,28.07 143.98,28.07 143.98,-3.36 -2.39,-3.36
  pour Top (rank 2, no thermals): -2.39,43.95 7.77,43.95 7.77,23.72 arc55 9.92,19.57 12.05,18.07 arc30 14.54,17.16 55.72,13.52 arc-28 56.88,13.12 63.02,8.48 arc33 65.36,8.07 90.26,9.02 arc-3 93.57,9.02 130.65,5.93 arc64 133,7.23 135.14,11.08 arc25 135.45,12.12 136.68,28.07 143.98,28.07 143.98,-3.36 -2.39,-3.36